# EAGLE schematic SAE_Shifter_Schem_designday (EAGLE 6.1)
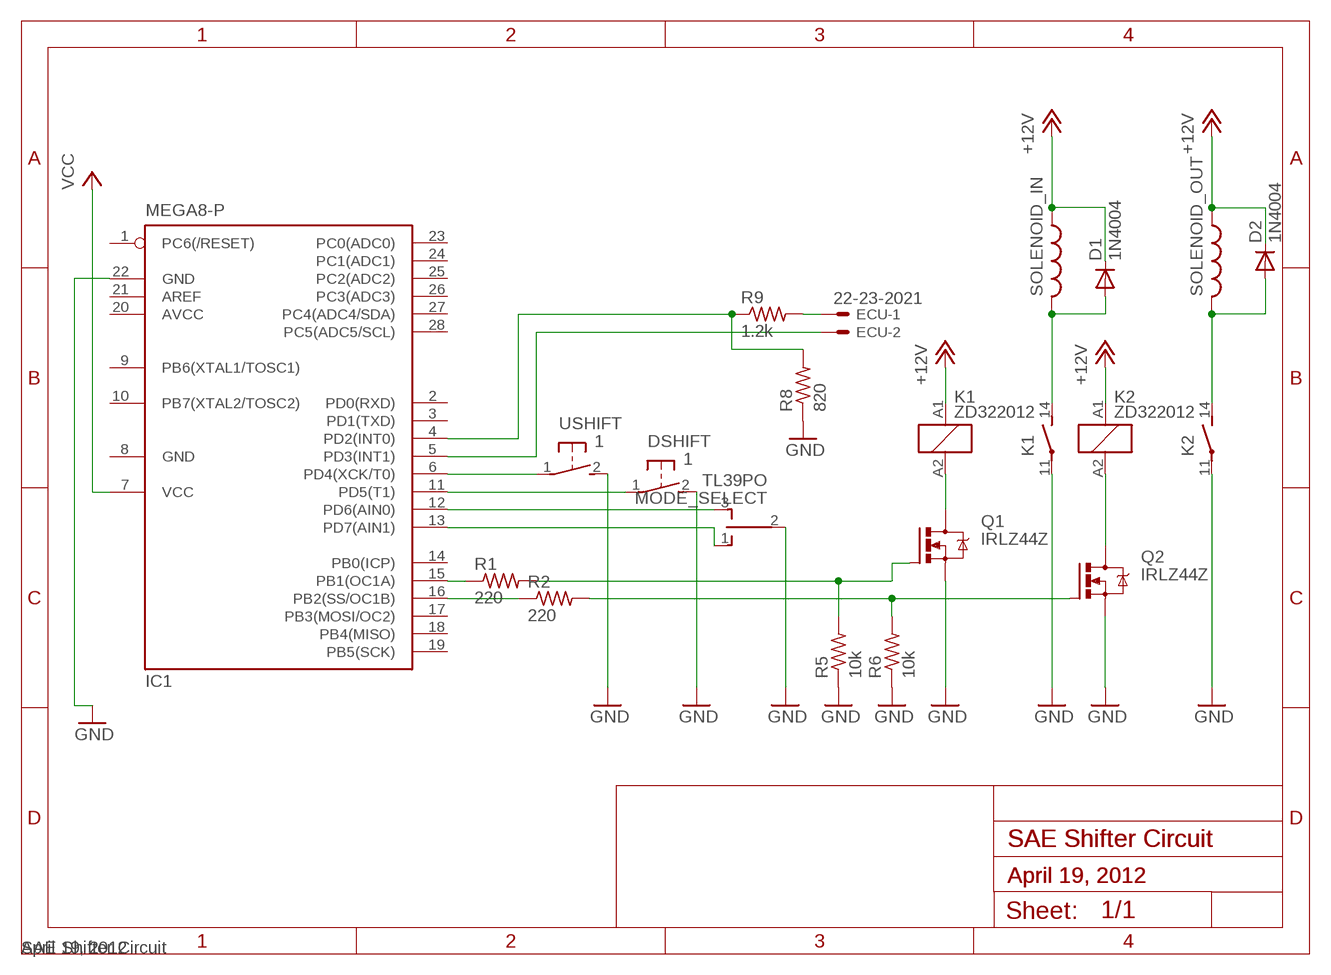
[diagram p0: schematic, sheet 1]
FRAME (DINA5_L): DRAWING_NAME: SAE Shifter Circuit; LAST_DATE_TIME: April 19, 2012

## Parts
D1  1N4004  [DO41-10]
D2  1N4004  [DO41-10]
DSHIFT  1  31-XX  [B3F-31XX]
ECU  22-23-2021  [22-23-2021]
IC1  MEGA8-P  [DIL28-3]
K1  ZD322012  [ZD2]
K2  ZD322012  [ZD2]
MODE_SELECT  TL39PO  [TL3XPO]
Q1  IRLZ44Z  [TO220BH]
Q2  IRLZ44Z  [TO220BH]
R1  220  R-US_0207/10  [0207/10]
R2  220  R-US_0207/10  [0207/10]
R5  10k  R-US_0207/10  [0207/10]
R6  10k  R-US_0207/10  [0207/10]
R8  820  R-US_0207/10  [0207/10]
R9  1.2k  R-US_0207/10  [0207/10]
SOLENOID_IN  L-US0207/10  [0207/10]
SOLENOID_OUT  L-US0207/10  [0207/10]
USHIFT  1  31-XX  [B3F-31XX]

## Nets
+12V: D1.C D2.C K1.A1 K2.A1 SOLENOID_IN.1 SOLENOID_OUT.1
GND: DSHIFT.2(S) IC1.22(GND) K1.11(2:P) K2.11(2:P) MODE_SELECT.2(P) Q1.S Q2.S R5.1 R6.1 R8.1 USHIFT.2(S)
N$1: K1.A2 Q1.D
N$2: IC1.6(PD4(XCK/T0)) USHIFT.1(P)
N$3: DSHIFT.1(P) IC1.11(PD5(T1))
N$4: IC1.12(PD6(AIN0)) MODE_SELECT.3(S)
N$5: IC1.16(PB2(SS/OC1B)) R2.1
N$6: IC1.13(PD7(AIN1)) MODE_SELECT.1(O)
N$7: K2.A2 Q2.D
N$8: Q2.G R2.2 R6.2
N$9: Q1.G R1.2 R5.2
N$10: IC1.4(PD2(INT0)) R8.2 R9.1
N$11: IC1.15(PB1(OC1A)) R1.1
N$12: ECU.1 R9.2
N$14: ECU.2 IC1.5(PD3(INT1))
N$15: D1.A K1.14(2:S) SOLENOID_IN.2
N$16: D2.A K2.14(2:S) SOLENOID_OUT.2
VCC: IC1.7(VCC)
Unconnected: IC1.1(PC6(/RESET)) IC1.2(PD0(RXD)) IC1.3(PD1(TXD)) IC1.9(PB6(XTAL1/TOSC1)) IC1.10(PB7(XTAL2/TOSC2)) IC1.14(PB0(ICP)) IC1.17(PB3(MOSI/OC2)) IC1.18(PB4(MISO)) IC1.19(PB5(SCK)) IC1.21(AREF) IC1.23(PC0(ADC0)) IC1.24(PC1(ADC1)) IC1.25(PC2(ADC2)) IC1.26(PC3(ADC3)) IC1.27(PC4(ADC4/SDA)) IC1.28(PC5(ADC5/SCL))

## Power pins joined to a net without a drawn wire
AVCC: IC1.20(AVCC)
GND: IC1.8(GND)

## Library data of the parts
D1 D2 = diode:1N4004: DIODE general purpose rectifier, 1 A
DSHIFT USHIFT = switch-omron:31-XX: OMRON SWITCH; MPN: B3F-3100; OC_FARNELL: 959704; OC_NEWARK: 36M3582
ECU = con-molex:22-23-2021: .100" (2.54mm) Center Header - 2 Pin; MF: MOLEX; MPN: 22-23-2021; OC_FARNELL: 1462926; OC_NEWARK: 25C3832
IC1 = atmel:MEGA8-P: MICROCONTROLLER 8 Kbytes FLASH, 1 kbytes SRAM, 512 bytes EEPROM, USART, 4-channel 10 bit ADC, 2-channel 8 bit ADC Pin compatible with Atmega48, ATMega88, ATMega168 Source: avr.lbr; OC_FARNELL: unknown; OC_NEWARK: unknown
K1 K2 = relay:ZD?2*: Power Relay SCHRACK 1 pole 30 A Source: http://www.schrack.com/.. 5848.pdf; OC_FARNELL: unknown; OC_NEWARK: unknown
MODE_SELECT = switch:TL39PO: TINY SWITCH ON OFF ON Source: http://www2.produktinfo.conrad.com/datenblaetter/700000-724999/705152-da-01-de-Subminiaturschalter_TL_36YO.pdf
Q1 Q2 = transistor-power:IRLZ44Z: N-Channel HEXFET® Power MOSFET Logic Level AUTOMOTIVE MOSFET Source: http://www.irf.com/product-info/datasheets/data/irlz44zpbf.pdf
R1 R2 R5 R6 R8 R9 = resistor:R-US_: RESISTOR, American symbol
SOLENOID_IN SOLENOID_OUT = rcl:L-US: INDUCTOR, American symbol